# EAGLE board TPadTabletBattery (EAGLE 6.3)
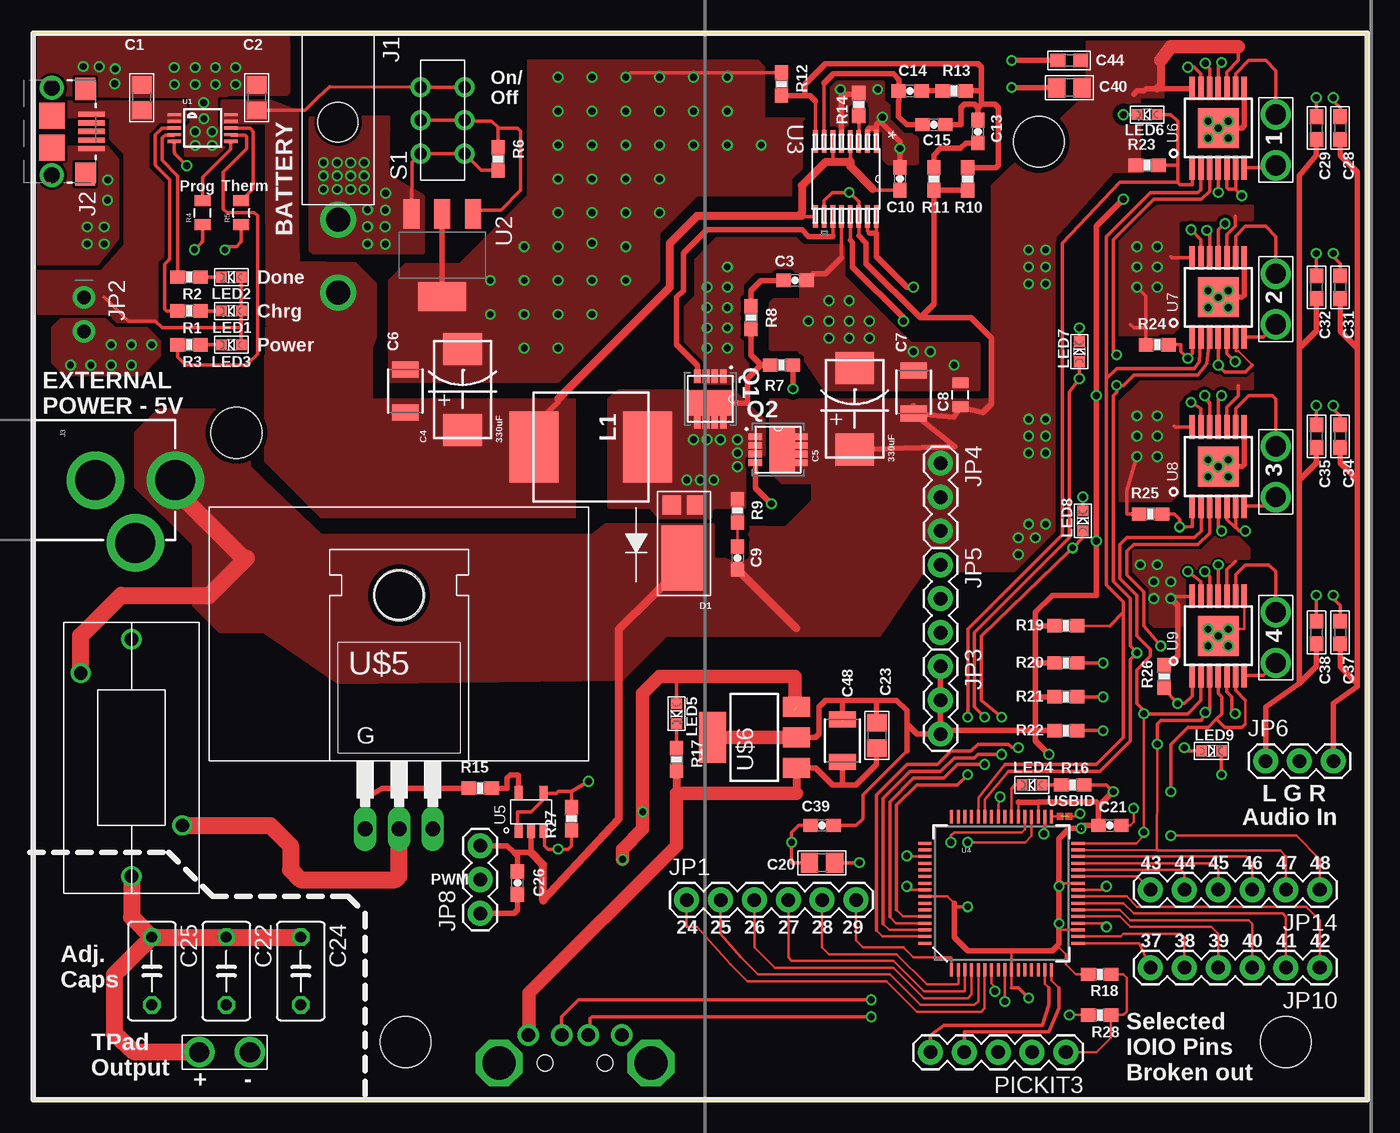
[diagram p5: board, top side]
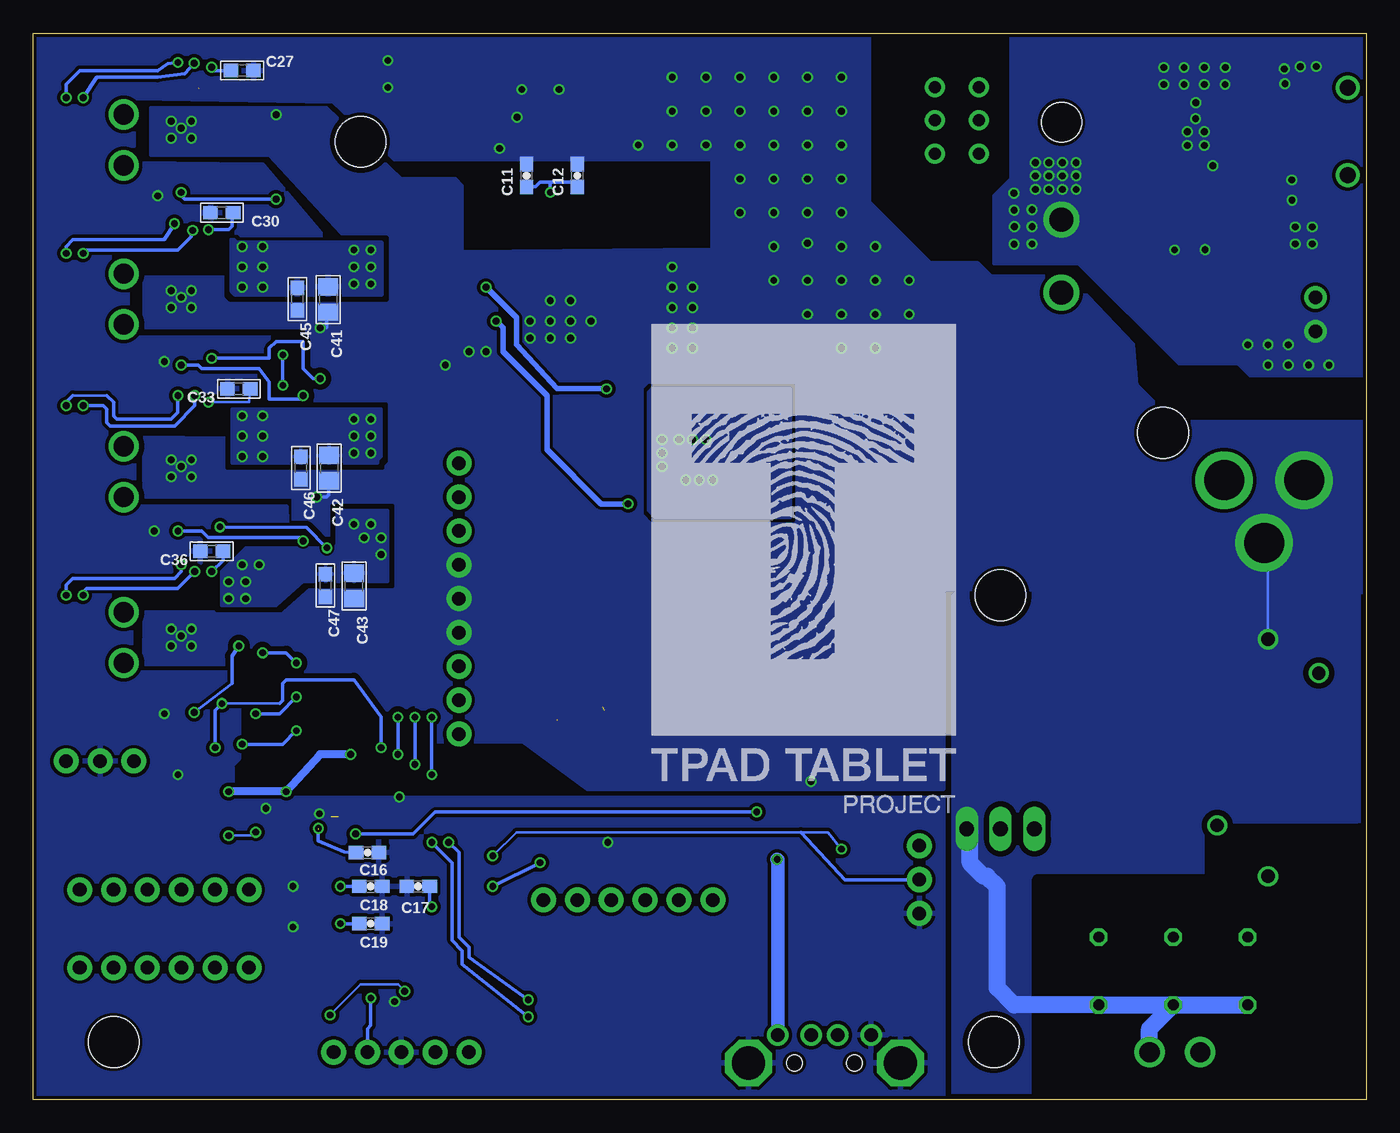
[diagram p6: board, bottom side, seen from below]

Size 100 x 80 mm. Coordinates in mm from the lower left corner, seen from the top.
Outline: 0,0 100,0 100,80 0,80 0,0
Copper layers (1*16): Top 0.035mm / dielectric 1.5mm / Bottom 0.035mm
Design rules "Fusion_eagle_rule_v1.1": minimum track width 6mil, minimum drill 12mil, track to track 6mil, track to pad 6mil, pad to pad 6mil, via to via 6mil, smd to smd 0mil, copper to edge 10mil, drill to drill 10mil, minimum pad ring 10mil, minimum via ring 6mil, stop-mask expansion 2mil, vias tented up to drill 100mil, thermal gap 10mil
Holes 3.81 mm at 93.98,4.32 75.44,71.88 27.94,4.32 15.24,50.04
bRestrict: area 0.5,12.7 to 11.7,20.3; area 0.5,0.3 to 24.7,16.5

## Footprints (pad centres in the part's own frame; a part is rotated, then mirrored left to right if it is on the bottom)
MICROBUILDER_0805 = smd 1.3 x 1.5: 1 -0.95,0; 2 0.95,0
0603-CAP = smd 1.1 x 1: 1 -0.85,0; 2 0.85,0
330UF_POSCAP = smd 2.4 x 2.9: + -3.05,0; - 3.05,0
1210 = smd 1.2 x 2: 1 -1.6,0; 2 1.6,0
0805 = smd 0.8 x 1.2: 1 -0.9,0; 2 0.9,0
C050-035X075 = drill 0.813 octagon: 1 -2.54,0; 2 2.54,0
MICROBUILDER_0603 = smd 1.1 x 1: 1 -0.85,0; 2 0.85,0
POWER-DIODE_PDS835L = smd 1.39 x 1.4: A1 -0.92,-3.98; A2 0.92,-3.98 | smd 3.36 x 4.86: C 0,0
MOLEX-MINI-FIT-JR-2POS-RA = drill 1.8: P1 0,0; P2 0,5.5 | hole 3: 0,-7.3
USBMICROBSMT = smd 0.4 x 2: P1 -1.3,2.975; P2 -0.65,2.975; P3 0,2.975; P4 0.65,2.975; P5 1.29,2.975 | smd 1.7 x 1.5: P$6 -3.2,2.5; P$7 3.2,2.5 | smd 1.9 x 1.9: P$8 -1.2,0; P$9 1.2,0 | drill 1.2 pad 1.7: P$10 -3.275,0; P$11 3.275,0
POWER_JACK_PTH = drill 2.997 pad 4.318: GND 0,7.7; GNDBREAK 4.7,10.7; PWR 0,13.7
1X06 = drill 1.016 pad 1.88: 1 0,0; 2 2.54,0; 3 5.08,0; 4 7.62,0; 5 10.16,0; 6 12.7,0
MICROBUILDER_1X02_ROUND = drill 1 pad 1.676: 1 -1.27,0; 2 1.27,0
1X03 = drill 1.016 pad 1.88: 1 0,0; 2 2.54,0; 3 5.08,0
1X02_BIG = drill 1.524: P$1 0,0; P$2 3.81,0
.82UH_INDUCTOR-IHLP3232DZERR82M01 = smd 3.683 x 5.334: P1 -4.242,0; P2 4.267,0
MICROBUILDER_CHIPLED_0603 = smd 0.8 x 0.8: A 0,-0.75; C 0,0.75
1X05 = drill 1.016 pad 1.88: 1 0,0; 2 2.54,0; 3 5.08,0; 4 7.62,0; 5 10.16,0
DQG8 = smd 1.016 x 0.508: 1 -1.702,0.965; 2 -1.702,0.33; 3 -1.702,-0.33; 4 -1.702,-0.965; 5 1.702,-0.991; 6 1.702,-0.33; 7 1.702,0.33; 8 1.702,0.965 | smd 1.9 x 3.25: PAD 0.31,0
0603-RES = smd 1.1 x 1: 1 -0.85,0; 2 0.85,0
SLIDE_SWITCH-JS202011CQN = drill 0.9 pad 1.5: A1 2.5,3.3; A2 2.5,0; B1 -2.5,3.3; B2 -2.5,0; C1 0,3.3; C2 0,0
MICROBUILDER_MSOP10 = smd 0.25 x 1: 1 -1,-2.113; 2 -0.5,-2.113; 3 0,-2.113; 4 0.5,-2.113; 5 1,-2.113; 6 1,2.113; 7 0.5,2.113; 8 0,2.113; 9 -0.5,2.113; 10 -1,2.113
SOT223 = smd 1.2 x 2.2: D1 0,-3.1; IN -2.3,-3.1; S 2.3,-3.1 | smd 3.6 x 2.2: D2 0,3.1
PW16 = smd 1.676 x 0.356: 1 -2.819,2.286; 2 -2.819,1.626; 3 -2.819,0.965; 4 -2.819,0.33; 5 -2.819,-0.33; 6 -2.819,-0.965; 7 -2.819,-1.626; 8 -2.819,-2.286; 9 2.819,-2.286; 10 2.819,-1.626; 11 2.819,-0.965; 12 2.819,-0.33; 13 2.819,0.33; 14 2.819,0.965; 15 2.819,1.626; 16 2.819,2.286
PIC24FXXX_TQFP64 = smd 0.22 x 1: 1 -3.75,-5.75; 2 -3.25,-5.75; 3 -2.75,-5.75; 4 -2.25,-5.75; 5 -1.75,-5.75; 6 -1.25,-5.75; 7 -0.75,-5.75; 8 -0.25,-5.75; 9 0.25,-5.75; 10 0.75,-5.75; 11 1.25,-5.75; 12 1.75,-5.75; 13 2.25,-5.75; 14 2.75,-5.75; 15 3.25,-5.75; 16 3.75,-5.75; 33 3.75,5.75; 34 3.25,5.75; 35 2.75,5.75; 36 2.25,5.75; 37 1.75,5.75; 38 1.25,5.75; 39 0.75,5.75; 40 0.25,5.75; 41 -0.25,5.75; 42 -0.75,5.75; 43 -1.25,5.75; 44 -1.75,5.75; 45 -2.25,5.75; 46 -2.75,5.75; 47 -3.25,5.75; 48 -3.75,5.75 | smd 1 x 0.22: 17 5.75,-3.75; 18 5.75,-3.25; 19 5.75,-2.75; 20 5.75,-2.25; 21 5.75,-1.75; 22 5.75,-1.25; 23 5.75,-0.75; 24 5.75,-0.25; 25 5.75,0.25; 26 5.75,0.75; 27 5.75,1.25; 28 5.75,1.75; 29 5.75,2.25; 30 5.75,2.75; 31 5.75,3.25; 32 5.75,3.75; 49 -5.75,3.75; 50 -5.75,3.25; 51 -5.75,2.75; 52 -5.75,2.25; 53 -5.75,1.75; 54 -5.75,1.25; 55 -5.75,0.75; 56 -5.75,0.25; 57 -5.75,-0.25; 58 -5.75,-0.75; 59 -5.75,-1.25; 60 -5.75,-1.75; 61 -5.75,-2.25; 62 -5.75,-2.75; 63 -5.75,-3.25; 64 -5.75,-3.75
MICROCHIP-MINI-DRIVER-MCP1416T-E/OT = smd 0.6 x 1.1: P1 -0.95,-1.4; P2 0,-1.4; P3 0.95,-1.4; P4 0.95,1.4; P5 -0.95,1.4
TI-AUDIOAMP-LM48100Q = smd 0.42 x 1.78: P$1 -1.95,-2.97; P$2 -1.3,-2.97; P$3 -0.65,-2.97; P$4 0,-2.97; P$5 0.65,-2.97; P$6 1.3,-2.97; P$7 1.95,-2.97; P$8 1.95,2.97; P$9 1.3,2.97; P$10 0.65,2.97; P$11 0,2.97; P$12 -0.65,2.97; P$13 -1.3,2.97; P$14 -1.95,2.97 | smd 3.1 x 3: P$15 0,0
USBA-THRU-FLUG = drill 1 pad 1.6: P1 3.5,4.85; P2 1,4.85; P3 -1,4.85; P4 -3.5,4.85 | drill 2.5 pad 3.5 octagon: S1 5.7,2.75; S2 -5.7,2.75 | hole 1.2: -2.25,2.75; 2.25,2.75
TRANSFORMER = drill 1: P1 16.51,3.81; P2 5.08,-3.81; S1 1.27,0; S2 19.05,0
TPAD_TO220 = drill 1.118 long: D 0,-5.08; G -2.54,-5.08; S 2.54,-5.08 | hole 3.81: 0,12.446
SOT223' = smd 1.5 x 2: 1 -2.3,-3.15; 2 0,-3.15; 3 2.3,-3.15 | smd 3.8 x 2: 4 0,3.15

## Placement (x,y rotation side)
C1  10uF  [MICROBUILDER_0805]  8.13,75.18 90 top
C2  10uF  [MICROBUILDER_0805]  16.76,75.18 90 top
C3  4700pF  [0603-CAP]  57.15,61.47 0 top
C4  330uF  [330UF_POSCAP]  32.2,53.28 90 top
C5  330uF  [330UF_POSCAP]  61.62,51.84 90 top
C6  47uF  [1210]  27.91,53.16 90 top
C7  47uF  [1210]  66.04,53.09 90 top
C8  10uF  [0805]  69.55,52.88 90 top
C9  4700pF  [0603-CAP]  52.83,40.64 270 top
C10  .47uF  [0603-CAP]  65.02,69.09 90 top
C11  .47uF  [0603-CAP]  62.99,69.34 90 bottom
C12  .47uF  [0603-CAP]  59.18,69.34 90 bottom
C13  220pF  [0603-CAP]  70.87,72.64 270 top
C14  1500pF  [0603-CAP]  65.79,75.69 180 top
C15  27pF  [0603-CAP]  67.56,73.15 180 top
C16  0.1uF  [0603-CAP]  74.93,18.54 180 bottom
C17  0.1uF  [0603-CAP]  71.12,16 0 bottom
C18  0.1uF  [0603-CAP]  74.68,16 180 bottom
C19  0.1uF  [0603-CAP]  74.68,13.21 180 bottom
C20  10uF  [MICROBUILDER_0805]  59.18,17.78 180 top
C21  0.1uF  [0603-CAP]  80.77,20.57 180 top
C22  [C050-035X075]  14.48,9.65 270 top
C23  10uF  [MICROBUILDER_0805]  63.3,27.33 270 top
C24  [C050-035X075]  20.07,9.65 270 top
C25  [C050-035X075]  8.89,9.65 270 top
C26  0.1uF  [0603-CAP]  36.32,16.26 90 top
C27  2.2uF  [MICROBUILDER_0603]  84.33,77.22 0 bottom
C28  0.47uF  [MICROBUILDER_0603]  98.04,72.9 270 top
C29  0.47uF  [MICROBUILDER_0603]  96.27,72.9 270 top
C30  2.2uF  [MICROBUILDER_0603]  85.85,66.55 180 bottom
C31  0.47uF  [MICROBUILDER_0603]  98.04,60.96 270 top
C32  0.47uF  [MICROBUILDER_0603]  96.27,60.96 270 top
C33  2.2uF  [MICROBUILDER_0603]  84.58,53.34 180 bottom
C34  0.47uF  [MICROBUILDER_0603]  98.04,49.78 270 top
C35  0.47uF  [MICROBUILDER_0603]  96.27,49.78 270 top
C36  2.2uF  [MICROBUILDER_0603]  86.61,41.15 180 bottom
C37  0.47uF  [MICROBUILDER_0603]  98.04,35.05 270 top
C38  0.47uF  [MICROBUILDER_0603]  96.27,35.05 270 top
C39  0.1uF  [0603-CAP]  59.18,20.57 0 top
C40  10uF  [MICROBUILDER_0805]  77.72,75.95 180 top
C41  10uF  [MICROBUILDER_0805]  77.88,60.05 270 bottom
C42  10uF  [MICROBUILDER_0805]  77.8,47.4 270 bottom
C43  10uF  [MICROBUILDER_0805]  75.95,38.56 270 bottom
C44  0.1uF  [MICROBUILDER_0603]  77.72,77.98 180 top
C45  0.1uF  [MICROBUILDER_0603]  80.19,60.07 270 bottom
C46  0.1uF  [MICROBUILDER_0603]  79.93,47.4 270 bottom
C47  0.1uF  [MICROBUILDER_0603]  78.08,38.58 270 bottom
C48  47uF  [1210]  60.71,26.92 270 top
D1  [POWER-DIODE_PDS835L]  48.82,40.64 180 top
J1  MOLEX-MINI-FIT-JR-2POS-RA  [MOLEX-MINI-FIT-JR-2POS-RA]  22.86,66.04 180 top
J2  USB IN  [USBMICROBSMT]  1.4,72.64 270 top
J3  POWER_JACKPTH  [POWER_JACK_PTH]  -3.05,46.48 270 top
JP1  [1X06]  49.02,14.99 0 top
JP2  AUX IN  [MICROBUILDER_1X02_ROUND]  3.81,58.93 270 top
JP3  3.3V  [1X03]  68.07,32.51 270 top
JP4  5V  [1X03]  68.07,47.75 270 top
JP5  GND  [1X03]  68.07,40.13 270 top
JP6  [1X03]  92.46,25.4 0 top
JP7  [1X02_BIG]  12.45,3.56 0 top
JP8  [1X03]  33.53,13.97 90 top
JP9  [1X02_BIG]  93.22,70.1 90 top
JP10  [1X06]  96.52,9.91 180 top
JP11  [1X02_BIG]  93.22,58.17 90 top
JP12  [1X02_BIG]  93.22,45.21 90 top
JP13  [1X02_BIG]  93.22,32.77 90 top
JP14  [1X06]  96.52,15.75 180 top
L1  .82uH  [.82UH_INDUCTOR-IHLP3232DZERR82M01]  41.83,48.97 180 top
LED1  CHRG  [MICROBUILDER_CHIPLED_0603]  14.86,59.18 90 top
LED2  DONE  [MICROBUILDER_CHIPLED_0603]  14.86,61.72 90 top
LED3  PG  [MICROBUILDER_CHIPLED_0603]  14.86,56.64 90 top
LED4  ORANGE  [MICROBUILDER_CHIPLED_0603]  74.93,23.62 90 top
LED5  +5V  [MICROBUILDER_CHIPLED_0603]  48.26,28.96 180 top
LED6  F1  [MICROBUILDER_CHIPLED_0603]  83.57,73.91 90 top
LED7  F2  [MICROBUILDER_CHIPLED_0603]  78.49,56.13 0 top
LED8  F3  [MICROBUILDER_CHIPLED_0603]  78.74,43.43 0 top
LED9  F4  [MICROBUILDER_CHIPLED_0603]  88.39,26.16 270 top
PICKIT3  [1X05]  77.47,3.56 180 top
Q1  NCH  [DQG8]  50.8,52.58 270 top
Q2  PCH  [DQG8]  55.88,48.77 0 top
R1  330  [0603-RES]  11.68,59.18 180 top
R2  330  [0603-RES]  11.68,61.72 180 top
R3  330  [0603-RES]  11.68,56.64 180 top
R4  1K  [0805]  12.7,66.55 90 top
R5  10k  [0805]  15.6,66.55 90 top
R6  10K  [0603-RES]  34.87,70.59 270 top
R7  1K  [0603-RES]  56.13,55.12 180 top
R8  4.7  [0603-RES]  53.85,58.67 270 top
R9  4.7  [0603-RES]  52.83,44.2 90 top
R10  100K  [0603-RES]  70.1,69.09 270 top
R11  10K  [0603-RES]  67.56,69.09 270 top
R12  19.1K  [0603-RES]  56.13,76.2 270 top
R13  17.8K  [0603-RES]  69.09,75.69 180 top
R14  63.4K  [0603-RES]  61.93,74.68 90 top
R15  22  [0603-RES]  33.53,23.37 0 top
R16  330  [0603-RES]  77.98,23.62 180 top
R17  330  [0603-RES]  48.26,25.53 270 top
R18  10K  [0603-RES]  80.01,9.4 0 top
R19  1.5k  [0603-RES]  77.47,35.56 0 top
R20  1.5k  [0603-RES]  77.47,32.77 0 top
R21  1.5k  [0603-RES]  77.47,30.23 0 top
R22  1.5k  [0603-RES]  77.47,27.69 0 top
R23  1.5k  [0603-RES]  83.57,70.1 0 top
R24  1.5k  [0603-RES]  84.33,56.64 0 top
R25  1.5k  [0603-RES]  83.82,43.94 0 top
R26  1.5k  [0603-RES]  84.84,31.75 270 top
R27  10K  [0603-RES]  40.39,21.08 90 top
R28  330  [0603-RES]  80.01,6.35 180 top
S1  SLIDE_SWITCH-JS202011CQN  [SLIDE_SWITCH-JS202011CQN]  32.36,73.48 90 top
U1  MCP73833-AMI/UN  [MICROBUILDER_MSOP10]  12.7,72.9 270 top
U2  [SOT223]  30.68,63.35 180 top
U3  [PW16]  60.96,69.09 270 top
U4  PIC24FJ256GB206  [PIC24FXXX_TQFP64]  72.64,15.49 0 top
U5  MICROCHIP-MINI-DRIVER-MCP1416T-E/OT  [MICROCHIP-MINI-DRIVER-MCP1416T-E/OT]  37.34,21.59 0 top
U6  [TI-AUDIOAMP-LM48100Q]  88.9,72.9 0 top
U7  [TI-AUDIOAMP-LM48100Q]  88.9,60.2 0 top
U8  [TI-AUDIOAMP-LM48100Q]  88.9,47.5 0 top
U9  [TI-AUDIOAMP-LM48100Q]  88.9,34.8 0 top
U$1  USBA-THRU-PLUG  [USBA-THRU-FLUG]  40.64,0 0 top
U$2  [TPADTABLETPROJECT]  53.64,21.16 0 bottom
U$4  TRANSFORMER  [TRANSFORMER]  7.37,15.49 90 top
U$5  [TPAD_TO220]  27.43,25.4 0 top
U$6  LD33V  [SOT223']  54.1,27.18 90 top

## Tracks (layer width: path | path; a pad name or v marks a point on that pad's centre or on a via)
5V_USB  (via drill 0.51)  (1 unrouted)
  Top 0.254: LED5.A 48.26,31.75 | U4.34 75.89,20.01 v75.82,19.94
  Top 1.016: v44.2,18.03 44.2,18.8 45.72,20.32 v45.72,21.59 45.72,22.86 45.72,30.48 46.99,31.75 48.26,31.75 57.15,31.75 57.15,29.21
  Bottom 0.254: v75.82,19.94 71.5,19.94 69.85,21.59 v45.72,21.59
  Bottom 1.016: U$1.P1 44.14,17.98 v44.2,18.03
+3V3  (via drill 0.51)  (2 unrouted)
  Top 0.203: U7.P$6 90.2,56.16 90.39,56.16 91.44,55.12 | 90.93,29.97 90.93,28.19 | 73.39,8.39 U4.10 73.39,11.16 73.41,11.18 | U4.38 73.89,22.33 73.91,22.35 | U4.26 77.23,16.24 76.96,16.51 | U4.19 77.17,12.74 76.96,12.95 | U4.57 68.58,15.24 69.09,14.73 | U4.35 75.39,22.31 75.44,22.35 | R18.1 78.23,9.4 77.47,10.16 77.47,10.92 76.83,11.56
  Top 0.254: U6.P$4 v88.9,68.07 | U7.P$4 v88.9,55.12 89.41,54.61 90.93,54.61 91.44,55.12 | U8.P$4 88.9,42.93 v89.15,42.67 | v85.34,23.11 85.34,26.67 86.61,27.94 88.14,27.94 88.77,28.57 | 88.77,28.57 89.15,28.96 89.15,30.23 88.9,30.48 U9.P$4 | U9.P$6 90.2,30.7 90.93,29.97 | 90.93,28.19 90.68,27.94 89.41,27.94 88.77,28.57 | 73.39,8.39 73.9,8.39 v74.68,7.62 | v70.1,14.48 69.09,14.48 | C39.2 61.72,20.57 62.23,21.08 62.23,22.86 65.53,26.16 | R16.1 80.52,23.62 v81.03,23.11
  Top 0.406: U$6.2 58.67,27.18 58.93,27.43 58.93,29.46 59.44,29.97 60.71,29.97 | JP3.3 JP3.2 JP3.1 | 75.18,27.69 68.33,27.69 JP3.3 | R22.1 75.18,27.69 | 75.18,27.69 75.18,29.97 | 75.18,29.97 75.18,32.77 | 75.18,32.77 75.18,35.31 | 75.18,35.31 75.44,35.56 R19.1 | R20.1 75.18,32.77 | R21.1 76.62,30.39 | 76.62,30.39 76.71,30.48 | 76.62,30.39 76.45,30.23 75.44,30.23 75.18,29.97 | v81.79,67.56 79.76,65.53 v79.76,52.83 v79.76,41.91 79.76,37.85 76.45,37.85 75.18,36.58 75.18,35.31 | 75.18,27.69 75.18,26.92 v76.2,25.91 | 80.01,22.1 79.92,22.01 C21.2 78.61,20.57 v78.61,20.34 77.75,20.34 76.96,19.56 76.96,16.51 v76.96,16 v76.96,13.21 76.96,12.95 76.96,11.68 76.83,11.56 76.45,11.18 73.41,11.18 | 80.01,22.1 v81.03,23.11 | 75.39,22.31 73.92,22.31 73.89,22.33 | 73.39,11.16 70.12,11.16 69.09,12.19 69.09,14.48 69.09,14.73 | 75.44,22.35 79.76,22.35 80.01,22.1 | 60.71,28.45 60.71,29.97 | 60.71,29.97 63.25,29.97 | 65.53,28.19 65.53,26.16 | 63.25,29.97 64.77,29.97 65.53,29.21 65.53,28.19 | 63.25,29.97 63.25,28.33 C23.1 | 65.53,28.19 66.29,27.43 JP3.3
  Top 1.016: U$6.2 U$6.4
  Bottom 0.254: v88.9,68.07 88.9,67.82 88.65,67.56 v81.79,67.56 | v88.9,55.12 87.63,55.12 87.38,54.86 83.06,54.86 82.3,53.85 82.3,52.58 80.01,52.58 v79.76,52.83 | v89.15,42.67 87.38,42.67 86.87,42.16 80.01,42.16 v79.76,41.91 | v74.68,7.62 74.68,5.59 74.93,5.33 PICKIT3.2 | C17.2 70.27,14.64 v70.1,14.48 | C19.2 v76.96,13.21 | C18.2 v76.96,16 | C16.2 76.67,18.61 78.61,19.41 78.61,20.3
  Bottom 0.61: v76.2,25.91 78.49,25.91 v81.03,23.11 v85.34,23.11
+5V_IN
  Top 0.254: LED1.A LED2.A | LED1.A LED3.A | LED1.A 15.61,58.03 15.49,57.91 9.65,57.91 9.14,58.42 7.11,58.42 5.33,60.2
  pour Top (isolate 0.203, no thermals): -0.08,59 -0.13,62.13 5.13,62.13 6.91,64.11 6.91,70.97 5.79,72.09 5.79,73.71 5.74,73.76 0.13,73.76 -0.03,73.91 -0.03,74.83 11.3,74.83 11.4,74.73 11.4,73.53 11.28,73.41 9.5,73.41 8.59,72.49 8.59,69.9 9.7,68.78 9.7,63.45 9.68,63.42 9.68,63.27 9.27,62.87 9.27,58.42 9.3,58.39 6.3,58.39 5.69,59
BOOT
  Top 0.203: U4.39 73.39,23.36 73.41,23.37
  Top 0.254: LED4.C 73.66,23.62 73.41,23.37
CHARGING
  Top 0.254: U1.3 9.76,72.9 arc45 9.58,72.82 9.14,72.39 9.14,70.23 arc45 9.22,70.06 10.24,69.04 10.24,63.17 arc-45 10.16,62.99 9.86,62.69 9.86,59.33 10.01,59.18 R1.2
D+  (via drill 0.51)
  Top 0.203: U4.37 74.39,20.29 74.17,20.07 69.09,20.07 68.83,19.81 v68.83,19.3
  Top 0.254: v62.87,7.49 40.89,7.49 39.62,6.22 39.62,4.87 U$1.P3
  Bottom 0.254: v62.87,7.49 67.31,10.67 67.31,11.43 68.07,12.19 68.07,18.54 v68.83,19.3
D-  (via drill 0.51)
  Top 0.203: U4.36 74.89,19.78 74.42,19.3 v70.1,19.3
  Top 0.254: v62.87,6.22 41.91,6.22 41.78,6.1 41.78,4.99 U$1.P2
  Bottom 0.254: v62.87,6.22 67.82,10.16 67.82,11.18 68.58,11.94 68.58,17.78 v70.1,19.3
DONE
  Top 0.254: R2.2 10.83,69.2 arc45 10.76,69.38 9.65,70.48 9.65,72.06 arc-45 9.73,72.24 9.73,72.24 arc45 9.77,72.26 9.88,72.36 10.51,72.36 arc45 U1.4 10.57,72.42
FAULT1  (via drill 0.51)
  Top 0.203: U4.60 65.25,13.74 64.77,14.22
  Top 0.254: U6.P$1 86.95,68.66 86.02,68.66 85.85,68.83 | 85.85,68.83 81.53,68.83 77.22,64.26 77.22,42.42 70.1,35.31 v70.1,28.7 | 85.85,68.83 85.85,70.1 | 85.85,70.1 R23.2 | v70.1,24.38 69.34,23.62 66.29,23.62 64.77,22.1 64.77,14.22 | LED6.A 85.34,73.91 85.85,73.41 85.85,70.1
  Bottom 0.254: v70.1,28.7 v70.1,24.38
FAULT2  (via drill 0.51)
  Top 0.203: U4.61 64.73,13.24 64.26,13.72
  Top 0.254: U7.P$1 86.95,55.96 v86.61,55.63 86.11,56.13 86.11,56.64 R24.2 | v71.37,28.7 70.61,29.46 70.61,35.05 77.72,42.16 77.72,53.09 v78.49,54.1 LED7.A | v71.37,25.15 69.34,25.15 68.33,24.13 66.04,24.13 64.26,22.35 64.26,13.72
  Bottom 0.254: v86.61,55.63 82.3,55.63 82.3,56.39 81.79,56.9 79.76,56.9 79.76,54.86 78.99,54.1 v78.49,54.1 | v71.37,28.7 v71.37,25.15
FAULT3  (via drill 0.51)
  Top 0.203: U4.62 64.22,12.74 63.75,13.21
  Top 0.254: U8.P$1 86.95,43.01 86.51,42.98 v86,42.98 86,43.54 85.6,43.94 R25.2 | v72.64,28.7 71.12,29.97 71.12,34.8 77.72,41.15 v77.98,41.4 78.74,42.16 LED8.A | v72.64,25.91 70.87,25.91 70.61,25.65 69.09,25.65 68.07,24.64 65.79,24.64 63.75,22.61 63.75,13.21
  Bottom 0.254: v86,42.98 79.5,42.93 v77.98,41.4 | v72.64,28.7 v72.64,25.91
FAULT4  (via drill 0.51)
  Top 0.203: U4.63 63.7,12.24 63.25,12.7
  Top 0.254: U9.P$1 86.95,30.31 86.36,29.72 v85.85,29.72 85.69,29.88 R26.2 | v73.91,26.42 73.41,26.42 73.15,26.67 70.87,26.67 70.36,26.16 68.83,26.16 67.82,25.15 65.53,25.15 63.25,22.86 63.25,12.7 | LED9.A 86.61,26.16 v86.36,26.42
  Bottom 0.203: v85.85,29.72 81.53,29.72
  Bottom 0.254: 81.53,29.72 81.28,29.97 81.28,31.24 81.03,31.5 75.95,31.5 73.91,28.7 v73.91,26.42 | v86.36,26.42 86.36,29.21 v85.85,29.72
GND  (via drill 0.51)  (2 unrouted)
  Top 0.203: U4.9 v72.89,7.36 | U4.41 72.39,22.1 v72.54,22.71 | C21.1 82.3,20.57 82.55,20.83 v82.55,21.84 | U4.25 80.26,15.74 v80.52,16 | U4.20 80.23,13.24 v80.52,12.95 | v89.66,35.31 90.85,35.31 U9.P$8 | U4.33 77.09,21.24 77.09,21.34 | v78.54,21.46 78.38,21.46 78.18,21.26 77.67,21.26
  Top 0.254: R12.1 44.79,77.05 v44.45,76.71 | U6.P$5 89.55,68.44 89.66,68.33 90.17,68.33 | U6.P$6 90.2,68.36 90.17,68.33 | U7.P$5 89.55,55.99 v90.17,55.37 | 90.17,68.33 v90.68,67.82 | U8.P$5 89.55,43.55 90.17,42.93 90.2,42.96 | U8.P$6 90.2,42.96 | v90.93,42.67 90.48,42.67 90.2,42.96 | U9.P$5 89.55,30.59 89.92,30.23 89.92,29.21 v90.17,28.96 | C20.2 56.9,17.78 v56.9,19.3 56.9,20.07 57.4,20.57 C39.1 | R27.2 40.39,23.11 | 40.39,23.11 v41.66,23.88 | U5.P1 36.32,20.26 36.32,21.59 37.34,21.59 38.29,22.54 U5.P4 39.25,22.99 39.37,23.11 40.39,23.11 | 60.63,63.17 U3.12 | LED9.C 89.14,24.4 v89.15,24.38 | LED8.C v78.74,45.21 | LED7.C v78.49,57.91 | LED6.C v81.79,73.91
  Top 0.406: U2.D2 U2.D1 | 60.63,63.17 59.44,61.98 58.51,61.98 C3.2 | C10.2 v65.02,71.37 65.02,71.88 63.5,73.41 63.25,73.15 63.25,72.9 | 63.25,72.9 U3.1 | U3.2 62.59,72.75 62.74,72.9 63.25,72.9 | U3.5 60.63,75.36 60.71,75.44 61.84,75.44 R14.2 | C26.1 36.32,14.22 36.07,13.97 JP8.1 | U6.P$8 90.85,73.07 90.68,72.9 U6.P$15 | U8.P$8 90.85,47.67 90.68,47.5 U8.P$15 | U7.P$8 90.85,60.37 90.68,60.2 U7.P$15 | U$6.1 58.69,24.88 59.94,23.62 60.71,23.62 | 60.71,23.62 61.72,23.62 63.25,25.15 63.25,26.33 C23.2 | C48.2 60.71,23.62 | C40.2 v73.41,75.95 | C44.2 v73.41,77.98
  Top 0.61: U$6.1 57.25,22.96 | R17.2 48.26,22.99
  Top 1.016: 57.25,22.96 48.26,22.99 48.26,19.05 37.21,8 37.21,4.92 U$1.P4
  Bottom 0.203: U$4.S2 7.37,41.5 J3.GNDBREAK
  Bottom 0.254: v89.15,24.38 89.41,24.38 | v78.74,45.21 77.98,45.21 77.83,45.36 77.83,46.42 C42.2 | C41.2 77.88,58.78 77.98,58.67 77.98,57.91 v78.49,57.91
  Bottom 1.27: JP7.P$2 16.26,5.33 C22.2 | C22.2 C25.2 | C22.2 C24.2 26.42,7.11 27.69,8.38 27.69,16 28.45,16.76 28.7,16.76 29.72,17.78 29.72,20.07 U$5.S
  other vias: 39.37,76.71 39.37,74.17 39.37,71.63 39.37,69.09 39.37,66.55 52.07,76.71 39.37,61.47 39.37,58.93 39.37,56.39 36.83,56.39 36.83,58.93 36.83,61.47 36.83,64.01 34.29,58.93 41.91,58.93 41.91,61.47 41.91,64.26 41.91,69.09 41.91,71.63 41.91,74.17 41.91,76.71 44.45,74.17 44.45,71.63 44.45,69.09 44.45,66.55 44.45,64.01 44.45,61.47 39.37,64.01 52.07,71.63 41.91,66.55 49.53,71.63 46.99,74.17 54.61,71.63 46.99,69.09 46.99,71.63 49.53,74.17 46.99,76.71 49.53,76.71 52.07,74.17 52.07,56.39 59.69,58.42 59.69,57.15 61.21,57.15 61.21,58.42 62.74,58.42 62.74,57.15 50.55,56.39 50.55,57.91 52.07,57.91 52.07,59.44 50.55,59.44 59.69,59.94 61.21,59.94 50.55,60.96 52.07,60.96 60.55,75.79 63.35,75.79 63.7,73.71 34.29,61.47 52.07,62.48 58.17,58.42 88.14,35.31 88.14,34.04 89.66,34.04 89.66,46.74 88.14,46.74 88.14,48.01 89.66,48.01 89.66,59.44 88.14,59.44 89.66,60.71 88.14,60.71 89.66,72.14 88.14,72.14 88.14,73.41 89.66,73.41 66.04,56.13 67.31,56.13 69.09,55.12 46.99,66.55 88.9,60.2 88.9,47.5 88.9,34.8 88.9,72.9
  pour Top (no thermals): 32,62.74 27.94,62.74 26.67,61.47 26.67,53.85 39.37,53.85 46.99,61.47 46.99,65.02 49.78,67.82 56.9,67.82 56.9,69.09 57.66,69.85 57.66,73.41 57.91,73.66 54.86,73.66 54.86,77.47 54.36,77.98 37.08,77.98 37.08,67.82
  pour Bottom (isolate 0.254, rank 3, no thermals): 37.34,80.01 37.34,67.31 32.77,62.74 29.21,62.74 28.19,61.72 22.35,61.72 17.53,56.64 17.27,53.59 14.48,50.8 0,50.8 0,38.1 31.75,38.35 31.75,23.37 58.42,23.37 63.25,26.92 71.12,26.92 71.63,63.5 49.02,63.75 49.02,70.61 72.9,70.61 77.47,74.93 77.47,80.26
  pour Top (no thermals): 57.66,61.98 57.66,57.66 58.93,56.39 58.93,55.63 59.69,54.86 62.23,54.86 63.25,53.85 65.28,53.85 65.79,54.36 65.79,56.64 63.25,59.18 62.23,59.18 59.44,61.98
  pour Top (isolate 0.305, no thermals): 60.71,64.01 57.66,64.01 57.15,64.52 51.31,64.52 49.78,62.99 49.78,60.2 49.02,59.44 49.02,56.9 50.39,55.52 50.39,53.85 52.32,53.85 53.59,55.12 53.09,55.63 53.09,61.21 54.1,62.23 59.44,62.23 59.44,60.71 58.67,59.94 55.63,59.94 55.37,59.69 55.37,56.39 57.4,56.39 59.44,53.34 70.87,53.34 70.87,56.64 65.79,56.64 60.71,61.72
  pour Top (isolate 0.254, no thermals): 59.94,72.9 61.21,72.9 61.21,74.83 60.96,75.08 62.59,75.08 62.79,74.88 62.79,73 62.59,72.8 63.8,72.8 63.91,72.69 63.91,70.61 64.21,70.31 66.19,70.31 66.24,70.36 66.24,72.03 65.94,72.34 65.23,72.34 64.11,73.46 64.11,74.52 63.7,74.93 63.7,76.25 60.35,76.25 59.94,75.84
  pour Bottom (isolate 0.254, rank 2): 77.47,74.93 92.46,75.18 92.53,70.23 82.8,70.1 78.49,65.02 78.23,62.23 92.96,62.48 92.96,57.15 78.49,57.15 78.49,50.04 92.46,50.29 92.46,44.45 81.03,44.45 80.77,37.08 92.71,37.08 92.71,32 84.58,32 84.58,25.65 85.34,24.89 99.31,24.89 99.82,25.15 99.82,80.01 77.47,80.01
  pour Bottom (isolate 0.254): 99.82,22.86 99.82,24.89 85.09,24.89 85.09,23.37 84.84,22.61 31.75,22.61 31.75,-0.76 99.82,-0.76 100.08,-0.51
  pour Bottom (isolate 0.406, rank 3, no thermals): 67.82,63.75 67.82,68.58 68.33,69.09 72.39,69.09 77.98,74.42 91.19,74.42 91.19,70.87 82.3,70.87 76.45,64.52 78.23,62.74 78.74,61.72 91.69,61.72 91.69,57.91 79.5,57.91 79.3,49.58 91.74,49.73 91.69,45.21 80.52,45.21 80.52,38.35 82.04,36.58 91.69,36.58 91.72,32.64 84.86,32.64 84.84,25.65 77.22,25.65 71.37,29.46 71.63,63.75 68.07,63.5
  pour Bottom (isolate 0.406, no thermals): 30.99,37.85 30.99,-0.76 -0.08,0 0,37.85 -0.25,38.1 30.73,38.1
IN
  Top 0.254: R6.1 34.87,72.95 | 34.87,72.95 34.39,73.43 32.41,73.43 S1.C2 S1.C1 | U2.IN 33.03,66.75 35.08,66.75 36.55,68.22 36.55,72.67 36.32,72.9 34.92,72.9 34.87,72.95
LEFT
  Top 0.406: C29.2 96.27,70.87 95,69.34 95,56.39 | 95,56.39 95,46.48 | 95,46.48 95,31.24 | C32.2 96.27,57.66 95,56.39 | C35.2 96.27,47.75 95,46.48 | C38.2 96.27,32.51 95,31.24 | 95,31.24 92.46,29.46 JP6.1
MCLR
  Top 0.203: R18.2 81.79,9.4 82.04,9.14 82.04,6.6 81.79,6.35 R28.1 80.86,4.66 79.76,3.56 PICKIT3.1
N$2  (via drill 0.51)
  Top 0.254: U3.15 62.59,65.18 62.74,65.02 | U3.16 63.25,65.02
  Top 0.406: v66.04,60.96 65.53,60.96 63.25,63.25 63.25,65.02 62.74,65.02 | v57,53.34 57,55.1 R7.1
  Bottom 0.406: v57,53.34 60.71,53.34 63.75,56.64 63.75,58.67 v66.04,60.96
N$3
  Top 0.254: R2.1 LED2.C
N$4
  Top 0.254: LED1.C R1.1
N$5
  Top 0.254: R3.1 LED3.C
N$6  (via drill 0.51)
  Top 0.203: R28.2 v77.72,6.35 | v72.14,8.13 72.14,8.48 71.88,8.74 U4.7
  Bottom 0.203: v77.72,6.35 75.44,8.64 72.64,8.64 v72.14,8.13
N$7
  Top 0.203: C9.1 R9.1
N$8
  Top 0.254: 58.67,74.93 U3.8
  Top 0.406: C13.1 70.87,74.42 | 70.87,74.42 71.12,74.68 | C15.1 69.6,73.15 69.6,74.42 69.85,74.68 70.61,74.68 70.87,74.42 | R10.1 72.22,69.94 72.39,70.1 72.39,74.42 72.14,74.68 71.12,74.68 | 58.67,74.93 58.27,75.34 57.91,75.34 | 57.91,75.34 56.15,75.34 R12.2 | 70.1,75.69 R13.1 71.12,75.69 | 57.91,75.34 57.91,76.2 59.44,77.72 70.87,77.72 71.12,77.47 71.12,75.69 | 71.12,75.69 71.12,74.68
N$11
  Top 0.254: U3.7 59.33,76.25
  Top 0.406: C15.2 65.53,73.15 64.92,73.76 64.92,74.92 64.94,74.93 C14.2 64.94,76.54 64.52,76.96 60.05,76.96 59.33,76.25
N$12
  Top 0.406: R8.1 53.85,60.71 54.61,61.47 C3.1
N$13  (via drill 0.51)
  Top 0.203: U4.56 65.79,15.74 v65.53,16
  Top 0.254: v61.98,17.78 C20.1
  Bottom 0.254: v65.53,16 v61.98,17.78
N$14
  Top 0.254: U3.3 R14.1
N$15
  Top 0.406: R13.2 C14.1
N$16
  Top 0.254: R16.2 LED4.A
N$17
  Top 0.406: 67.56,70.36 R11.1 67.56,70.87 68.07,71.37 69.55,71.37 69.95,71.78 70.85,71.78 C13.2
N$18
  Top 1.27: U$4.P2 17.78,20.57 19.3,19.05 19.3,17.27 20.07,16.51 27.18,16.51 27.43,16.76 U$5.D
N$19
  Top 0.406: U5.P5 36.39,24.32 36.32,24.38 35.81,24.38 35.56,24.13 35.56,23.37 R15.2
N$20
  Top 1.27: U$4.S1 7.37,13.72 C25.1 | C25.1 C22.1 C24.1 | JP7.P$1 7.62,3.56 6.1,4.93 6.1,9.4 C25.1
N$21
  Top 0.254: LED5.C R17.1
N$23
  Top 0.406: R15.1 26.16,23.37 24.89,22.61 U$5.G
N$24  (via drill 0.51)  (1 unrouted)
  Top 0.254: 87.63,75.95 87.6,75.98 87.6,76.99 87.12,77.47 v86.61,77.47
  Bottom 0.254: v86.61,77.47 86.36,77.22 C27.1
N$25  (via drill 0.51)
  Top 0.254: U6.P$12 88.25,77.36 v87.94,77.78 | v96.27,75.18 C29.1
  Bottom 0.254: v87.94,77.78 88.65,76.96 90.68,76.71 95.25,76.71 v96.27,75.18
N$26  (via drill 0.51)
  Top 0.254: 88.9,75.69 U6.P$11 88.9,77.47 v89.15,77.83 | v97.54,75.18 97.54,74.93 98.04,74.42 C28.1
  Bottom 0.254: v89.15,77.83 89.92,77.72 90.68,77.22 96.52,77.22 97.54,76.2 v97.54,75.18
N$27  (via drill 0.51)
  Top 0.254: U7.P$13 87.6,64.55 v86.87,65.28
  Bottom 0.254: v86.87,65.28 85.34,65.28 85.09,65.53 85.09,66.46 C30.1
N$28  (via drill 0.51)
  Top 0.254: U7.P$12 88.25,64.91 v88.04,65.23 | v96.27,63.5 C32.1
  Bottom 0.254: v88.04,65.23 88.14,64.77 89.15,63.75 96.01,63.75 v96.27,63.5
N$29  (via drill 0.51)
  Top 0.254: U7.P$11 88.9,65.28 v89.41,65.73 | v97.54,63.5 97.54,63.25 98.04,62.74 C31.1
  Bottom 0.254: v89.41,65.73 90.17,64.52 97.03,64.52 97.54,64.01 v97.54,63.5
N$30  (via drill 0.51)
  Top 0.254: U8.P$13 87.6,51.85 v86.87,52.32
  Bottom 0.203: v86.87,52.32 83.82,52.32 C33.1
N$31  (via drill 0.51)
  Top 0.254: U8.P$12 88.25,52.21 v87.88,52.83 | v96.27,52.07 C35.1
  Bottom 0.254: v87.88,52.83 87.88,52.07 89.41,50.55 94.23,50.55 94.49,50.8 94.49,51.82 94.74,52.07 v96.27,52.07
N$32  (via drill 0.51)
  Top 0.254: U8.P$11 88.9,52.58 v89.15,52.83 | v97.54,52.07 97.54,51.82 98.04,51.31 C34.1
  Bottom 0.203: 97.03,52.83 94.49,52.83
  Bottom 0.254: v89.15,52.83 89.15,51.56 89.66,51.05 93.73,51.05 93.98,51.31 93.98,52.32 94.49,52.83 | v97.54,52.07 97.54,52.32 97.03,52.83
N$33  (via drill 0.51)
  Top 0.254: U9.P$13 87.6,38.89 v86.61,39.62
  Bottom 0.254: v86.61,39.62 85.75,40.45 C36.1
N$34  (via drill 0.51)
  Top 0.254: U9.P$12 88.25,39.26 v87.88,39.62 | v96.27,37.85 C38.1
  Bottom 0.254: v87.88,39.62 89.15,38.35 96.01,38.35 96.27,38.1 v96.27,37.85
N$35  (via drill 0.51)
  Top 0.254: U9.P$11 v88.9,40.13 | v97.54,37.85 97.54,37.59 98.04,37.08 C37.1
  Bottom 0.254: v88.9,40.13 88.9,39.62 89.41,39.12 97.03,39.12 97.54,38.61 v97.54,37.85
NGATE
  Top 0.254: 59.99,64.82 U3.11
  Top 0.406: Q1.4 49.84,55.07 48.26,56.64 48.26,60.2 48.77,60.71 48.77,63.5 50.55,65.28 57.66,65.28 58.17,64.77 59.94,64.77 59.99,64.82
OUT1+
  Top 0.254: U6.P$7 92.53,69.93 JP9.P$1
OUT2+
  Top 0.254: U7.P$7 92.28,57.23 JP11.P$1
OUT2-
  Top 0.254: U7.P$9 90.2,64.8 90.93,65.53 92.46,65.53 93.22,64.77 JP11.P$2
OUT3+
  Top 0.254: U8.P$7 92.53,44.53 JP12.P$1
OUT3-
  Top 0.254: JP12.P$2 93.22,52.58 92.96,52.83 91.19,52.83 90.2,51.85 U8.P$9
OUT4+
  Top 0.254: U9.P$7 92.28,31.83 JP13.P$1
OUT4-
  Top 0.254: JP13.P$2 93.22,39.62 92.71,40.13 90.93,40.13 90.2,39.4 U9.P$9
OUT-
  Top 0.254: U6.P$9 90.2,76.99 91.19,77.98 92.46,77.98 93.22,77.22 JP9.P$2
PG
  Top 0.254: R3.2 10.83,55.71 11.43,55.12 15.98,55.12 16.82,55.96 16.82,66.32 16.59,66.55 14.53,66.55 14.25,66.83 14.25,69.6 16,71.35 16,72.26 15.9,72.36 14.85,72.36 U1.7
PGATE  (via drill 0.51)
  Top 0.254: 61.29,64.49 U3.13
  Top 0.406: Q2.4 54.18,45.9 v55.37,44.7 | v65.28,58.42 65.28,58.67 61.47,62.48 61.47,64.31 61.29,64.49
  Bottom 0.406: v55.37,44.7 57.4,44.7 61.47,48.77 61.47,52.83 64.77,56.13 64.77,57.91 v65.28,58.42
PGEC1
  Top 0.203: U4.15 75.89,8.69 76.2,8.38
  Top 0.254: 76.2,8.38 76.2,7.11 75.69,5.59 68.33,5.59 67.31,4.83 PICKIT3.5
PGED1
  Top 0.203: U4.16 76.39,8.95 76.96,8.38
  Top 0.254: 76.96,8.38 76.96,6.86 76.2,5.08 69.85,5.08 PICKIT3.4
PIN24
  Top 0.203: JP1.6 61.72,11.94 62.23,11.43 65.28,11.43 66.04,10.67 68.83,10.67 68.89,10.61 U4.1
PIN25
  Top 0.203: JP1.5 59.18,11.43 59.69,10.92 64.77,10.92 67.06,8.64 69.34,8.64 69.39,8.69 U4.2
PIN26
  Top 0.203: JP1.4 56.64,10.67 56.9,10.41 64.52,10.41 66.8,8.13 69.85,8.13 69.89,8.17 U4.3
PIN27
  Top 0.203: JP1.3 54.1,11.43 55.63,9.91 64.52,9.91 66.8,7.62 70.1,7.62 70.39,7.91 U4.4
PIN28
  Top 0.203: JP1.2 51.56,12.45 53.09,10.67 54.36,9.4 64.26,9.4 66.55,7.11 70.61,7.11 70.89,7.39 U4.5
PIN29
  Top 0.203: JP1.1 49.02,12.95 49.78,12.95 52.32,10.16 53.59,8.89 64.01,8.89 66.29,6.6 71.12,6.6 71.37,6.86 71.37,9.72 U4.6
PIN37
  Top 0.203: U4.17 83,11.74 JP10.6
PIN38
  Top 0.203: U4.18 81.59,12.24 81.79,12.45 86.11,12.45 86.36,12.19 JP10.5
PIN39
  Top 0.203: U4.21 81.51,13.74 82.3,12.95 88.39,12.95 88.9,12.45 JP10.4
PIN40
  Top 0.203: U4.22 81.51,14.24 82.3,13.46 91.19,13.46 91.44,13.21 JP10.3
PIN41
  Top 0.203: U4.23 81.78,14.74 82.55,13.97 93.73,13.97 93.98,13.72 JP10.2
PIN42
  Top 0.203: U4.24 82.04,15.24 82.8,14.48 95.5,14.48 96.52,13.46 JP10.1
PIN43
  Top 0.203: U4.27 82.82,16.74 JP14.6
PIN44
  Top 0.203: U4.28 86.13,17.24 86.36,17.02 JP14.5
PIN45
  Top 0.203: U4.29 88.43,17.74 88.9,17.27 JP14.4
PIN46
  Top 0.203: U4.30 90.98,18.24 91.44,17.78 JP14.3
PROG
  Top 0.254: R4.2 12.7,69.22 14.81,71.32 U1.6
PWMOUT  (via drill 0.51)
  Top 0.203: U4.51 65.58,18.24 v65.53,18.29
  Top 0.254: U5.P3 38.35,20.12 38.35,19.05 38.61,18.8 v39.37,18.8 40.13,18.8 40.39,19.05 R27.1
  Bottom 0.203: v65.53,18.29 63.75,20.07 42.42,20.07 40.39,20.07 v39.37,18.8
  Bottom 0.254: JP8.2 39.12,16.51 42.42,20.07
RIGHT
  Top 0.406: C28.2 98.04,70.87 99.31,69.6 99.31,56.39 | 99.31,56.39 99.31,46.48 | 99.31,46.48 99.31,31.24 | C31.2 98.04,57.66 99.31,56.39 | C34.2 98.04,47.75 99.31,46.48 | C37.2 98.04,32.51 99.31,31.24 | 99.31,31.24 99.31,30.99 97.54,29.72 JP6.3
SCL0
  Top 0.203: U4.44 70.89,22.63 72.9,25.15 | R19.2 80.77,35.56
  Top 0.254: 72.9,25.15 79.76,25.15 81.79,27.18 81.79,36.58 | 80.77,35.56 81.79,36.58 | U6.P$2 87.6,68.3 87.38,68.07 83.82,68.07 80.52,64.77 80.52,54.1 | 80.52,54.1 80.52,38.61 81.79,37.34 81.79,36.58 | U7.P$2 87.5,55.39 87.12,54.86 81.28,54.86 80.52,54.1
SCL1  (via drill 0.51)
  Top 0.203: U4.32 82.74,19.24 83.31,19.81 v83.31,20.07 v83.31,28.96 | JP14.1 96.52,18.03 94.74,19.81 v85.34,19.81
  Top 0.254: v80.26,30.23 R21.2 | U8.P$2 87.63,44.5 87.63,42.67 87.12,42.16 82.04,42.16 81.53,41.66 81.53,39.12 82.8,37.85 82.8,34.8 83.82,33.78 83.82,33.27 82.8,32.26 82.8,29.72 83.31,29.21 v83.31,28.96 86.61,28.96 87.6,29.94 U9.P$2
  Bottom 0.203: v85.34,19.81 83.57,19.81 v83.31,20.07
  Bottom 0.254: v83.31,28.96 81.53,28.96 v80.26,30.23
SDA0  (via drill 0.51)
  Top 0.203: U4.43 71.39,22.52 73.15,24.64
  Top 0.254: 73.15,24.64 80.01,24.64 82.3,26.92 82.3,33.02 v82.8,33.53 82.3,34.04 82.3,37.59 81.03,38.86 81.03,52.83 81.28,53.09 v81.28,53.59 81.79,53.59 82.55,54.36 87.38,54.36 88.05,55.23 U7.P$3 | v80.26,32.77 R20.2 | U6.P$3 88.25,68.18 87.63,67.56 84.07,67.56 81.03,64.52 81.03,56.13 v81.28,55.88
  Bottom 0.254: v82.8,33.53 81.03,33.53 v80.26,32.77 80.52,32.77 | v81.28,55.88 v81.28,53.59
SDA1  (via drill 0.51)
  Top 0.203: U4.31 84.28,18.72 84.28,18.8 | 84.28,18.8 84.33,24.13 v84.33,26.67 | JP14.2 93.98,18.26 93.55,18.69 84.38,18.69 84.28,18.8
  Top 0.254: v80.26,27.69 R22.2 | v84.33,26.67 84.33,28.19 84.58,28.45 87.63,28.45 v87.94,29.06 88.25,29.07 U9.P$3 | U8.P$3 88.25,42.53 87.38,41.66 82.55,41.66 82.04,41.15 82.04,39.37 83.31,38.1 83.31,35.56 v84.58,34.04
  Bottom 0.203: 85.09,31.24 v87.94,29.06
  Bottom 0.254: v84.33,26.67 81.28,26.67 v80.26,27.69 | v84.58,34.04 85.09,33.27 85.09,31.24
SWITCH+  (via drill 0.51)
  Top 0.406: Q1.PAD 53.54,52.27 53.59,52.32 53.59,54.1 54.61,55.12 | R7.2 54.61,55.12 | 54.61,55.12 53.85,55.88 R8.2
  other vias: 51.05,46.48 50.04,46.48 49.02,46.48 52.83,48.51 52.83,47.5 52.83,49.53 51.56,49.53 50.55,49.53 49.53,49.53
  pour Top (isolate 0.254, no thermals): 43.18,52.58 43.18,44.45 46.23,44.45 46.99,43.69 50.8,43.69 50.8,44.2 51.05,44.45 53.34,44.45 53.34,48.21 54.81,48.21 54.81,51 52.53,53.16 43.89,53.16
  pour Bottom: 43.18,52.83 43.18,43.69 53.34,43.69 53.85,44.2 53.85,53.09 53.59,53.34 43.18,53.34
THERMAL
  Top 0.254: U1.8 16.26,72.9 16.51,72.64 16.51,68.36 R5.2
V+
  Top 0.254: C2.1 20.39,74.23 21.34,75.18 22.23,76.01 S1.A1 S1.A2 | U3.9 57.68,66.27 57.66,66.29 | U3.6 59.99,70.41 59.94,70.36 | U3.4 61.29,70.43 61.21,70.36 | C10.1 63.08,68.24 62.99,68.33
  Top 0.406: L1.P2 37.64,50.6 39.37,52.32 39.37,52.58
  Top 0.61: 39.37,52.58 47.75,60.96 47.75,64.26 49.78,66.29 57.4,66.29 | 57.66,66.29 57.4,66.29 | 61.29,70.43 61.29,70.03 62.99,68.33 | 61.21,70.36 60.05,70.36 59.99,70.41 | 59.94,70.36 59.44,70.36 57.66,68.58 57.66,66.55 57.4,66.29
  pour Top (no thermals): 14.17,73.28 14.17,74.93 17.78,74.93 19.81,74.17 19.81,65.79 19.86,62.79 24.13,62.74 25.65,61.21 25.65,57.4 24.89,56.39 19.3,56.39 17.53,58.17 17.5,73.3
  pour Top (isolate 0.406, no thermals): 17.37,47.9 21.59,43.69 40.64,43.69 40.64,52.58 25.4,52.58 25.4,56.39 25.76,57.3 17.37,57.96
V-  (via drill 0.51)
  Top 0.254: R5.1 15.6,64.47 arc-45 15.52,64.29 15.24,64.01 14.74,64.01 arc45 14.56,63.93 v14.38,63.75 | R4.1 12.7,64.49 arc-45 12.63,64.31 v12.09,63.78 | U1.5 10.59,71.1 arc45 10.66,70.92 v11.51,70.08 | U2.S 28.43,70.36 S1.B1 S1.B2 33.6,69.74 R6.2
  other vias: 5.31,65.48 4.04,65.48 4.04,64.21 5.31,64.21 5.56,67.49 5.59,69.01 12.14,77.44 13.67,76.17 15.19,76.17 15.19,77.44 13.67,77.44 5.84,56.64 7.37,56.64 8.89,56.64 4.32,55.12 5.84,55.12 7.37,55.12 12.14,76.17 10.59,76.17 10.57,77.44 6.15,77.34 6.1,76.23 2.79,55.12 25.07,64.21 26.42,64.19 26.39,65.51 25.07,65.51 26.42,66.75 26.44,68.02 4.95,77.5 3.73,77.52 25.07,65.51 21.77,68.3 22.78,68.3 23.8,68.3 24.82,68.3 24.82,69.32 23.8,69.32 22.78,69.32 21.77,69.32 25.07,66.78 24.82,70.31 23.8,70.31 22.78,70.31 21.77,70.31 12.14,72.62 13.41,72.62 13.41,71.6 12.14,71.6 12.8,73.61 12.78,74.8
  pour Top (no thermals): 5.38,58.52 2.11,58.52 1.45,57.91 1.45,55.32 2.36,54.41 8.08,54.41 9.45,55.78 9.45,56.92 8.53,57.84 6.1,57.84
  pour Top (no thermals): 20.78,73.66 20.78,63.75 20.98,63.55 29.24,63.55 29.26,67.79 26.59,69.32 26.64,73.74
  pour Top (isolate 0.203, no thermals): 0,62.74 4.83,62.74 6.32,64.59 6.32,70.54 5.54,71.45 0.15,71.5 0.05,71.4 0.05,62.79
  pour Top (isolate 0.203, rank 2, no thermals): 0,79.25 0,75.44 11.43,75.18 11.43,70.87 14.22,70.87 14.48,71.12 14.48,75.44 19.02,75.44 19.15,75.56 19.15,79.17 19.13,79.71 0.05,79.71
  pour Bottom (isolate 0.254, no thermals): 0,54.33 8.74,54.33 9.63,55.22 14.07,55.22 21.59,62.74 27.94,62.74 27.94,67.82 26.67,69.09 26.67,80.01 0,79.76
VCC  (via drill 0.51)
  Top 0.254: 61.92,64.82 U3.14 61.92,67.36 v61.21,68.07 59.94,68.07 59.33,67.46 U3.10 | 82.3,58.17 82.55,57.91 83.31,57.91 83.48,57.75 R24.1 83.48,60.29 v82.8,60.96 | 82.55,43.94 R25.1 82.04,43.94 82.04,45.72 v82.8,48.26 | U7.P$10 89.55,64.91 90.17,65.53 90.17,66.29 | U9.P$10 89.55,39.77 90.17,40.39 | U8.P$10 89.55,51.96 90.42,52.83 90.42,53.59 | U8.P$14 85.68,50.47 85.6,50.55 | U7.P$14 85.42,63.17 85.34,63.25 | U6.P$10 89.55,77.1 90.42,77.98 90.42,78.99 | U9.P$14 85.52,37.77 v85.34,37.59
  Top 0.406: C7.1 65.96,51.99 66.04,52.07 | 66.55,58.67 62.48,62.74 62.48,64.26 61.92,64.82 | 66.55,58.67 67.56,59.69 R11.2 R10.2 | C7.1 69.08,51.22 C8.1 71.24,51.56 71.88,52.21 71.88,57.15 70.36,58.67 66.55,58.67 | C5.+ 69.16,49.02 C7.1 | U6.P$14 84.33,75.87 83.49,75.87 83.31,75.69 82.8,75.69 82.55,75.44 | 82.55,70.27 R23.1 | R26.1 85.18,32.6 85.85,33.27 85.85,37.08 v85.34,37.59 | U5.P2 37.34,18.54 36.07,18.54 | C26.2 36.32,18.29 36.07,18.54 | JP8.3 35.56,19.05 36.07,18.54
  Top 0.61: 57.25,35.37 C9.2 | 48.26,39.62 46.48,37.85 43.94,35.31 43.94,21.08 38.26,14.94 38.26,17.62 37.34,18.54 | 84.58,77.98 84.58,76.12 84.33,75.87
  Top 1.016: 90.42,78.99 85.34,78.99 84.58,77.98
  Top 1.27: U$4.P1 3.56,34.8 6.6,37.85 13.21,37.85 16,40.64 15.75,40.64 9.91,46.48 J3.PWR
  Bottom 0.254: v61.21,68.07 61.21,68.83 | 61.21,68.83 59.52,68.83 C12.1 | C11.1 62.32,68.49 61.98,68.83 61.21,68.83
  other vias: 82.8,64.01 84.33,64.01 82.8,62.48 84.33,62.48 84.33,60.96 82.8,51.31 84.33,51.31 82.8,49.78 84.33,49.78 84.33,48.26 74.68,63.75 75.95,63.75 75.95,62.48 74.68,62.48 74.68,61.21 75.95,61.21 74.68,51.05 75.95,51.05 75.95,49.78 74.68,49.78 74.68,48.51 75.95,48.51 84.33,40.13 83.06,40.13 84.07,38.86 85.34,38.86 84.07,37.59 75.95,43.18 74.68,43.18 75.18,42.16 73.91,42.16 73.91,40.89
  pour Top (isolate 0.406, no thermals): 55.27,52.58 71.88,52.58 71.88,68.58 78.23,74.68 78.99,75.44 78.99,79.43 85.14,79.43 84.84,77.98 84.84,75.18 83.06,75.18 83.06,69.6 81.03,69.6 76.71,64.77 76.71,42.42 73.91,39.62 66.8,39.62 63.5,34.8 47.5,34.8 44.2,31.5 22.86,31.24 17.27,35.05 13.97,35.05 11.94,37.08 11.94,41.66 7.62,45.97 7.62,50.04 9.4,51.82 14.73,51.82 16.26,50.29 16.26,47.5 17.27,46.48 21.59,42.42 41.91,42.42 42.93,43.18 51.05,43.18 51.05,40.59 53.54,40.64 53.59,43.03 56.44,42.98 58.42,44.96 58.42,46.23 56.18,46.23 55.27,47.14
  pour Top (isolate 0.254, no thermals): 91.44,67.06 84.33,67.06 81.28,64.52 81.28,57.4 85.34,57.4 85.85,57.91 85.85,65.79 86.11,66.04 91.44,66.04
  pour Top (isolate 0.254, no thermals): 86.87,53.34 91.44,53.34 91.44,54.61 88.39,54.61 87.63,53.85 83.06,53.85 81.53,52.32 81.53,44.96 85.34,44.96 85.85,45.47 85.85,52.32
  pour Bottom (isolate 0.254): 73.91,64.26 84.84,64.26 85.09,64.52 85.09,60.71 84.84,60.45 73.91,60.45
  pour Bottom: 85.09,51.82 73.91,51.82 73.91,48.26 74.17,48.01 74.17,47.75 85.09,47.75
  pour Top: 86.11,35.56 84.07,35.56 83.82,35.81 83.82,38.35 82.55,39.62 82.55,41.15 87.63,41.15 88.65,42.16 90.42,42.16 91.19,41.4 91.19,40.64 90.42,40.64 90.17,40.39 88.65,40.39 88.14,39.88 86.36,39.88 86.36,35.81
  pour Bottom: 85.85,37.08 81.79,37.08 79.76,38.86 73.41,38.86 73.41,44.2 77.22,44.2 77.22,41.66 77.47,41.4 84.07,41.4 85.85,39.62
(copper drawn outside any net)
  shapes: Top area x2

## Text on the board
tPlace: On/ / Off | 1 | Prog | Therm | BATTERY | Done | 2 | Chrg | Power | EXTERNAL / POWER - 5V | 3 | 4 | USBID | L G R | Audio In | 43 | 44 | 45 | 46 | 47 | 48 | PWM | 24 | 25 | 26 | 27 | 28 | 29 | 37 | 38 | 39 | 40 | 41 | 42 | Adj. / Caps | TPad / Output | + | - | Selected / IOIO Pins / Broken out